# EAGLE schematic Atlas (EAGLE 9.2.2)
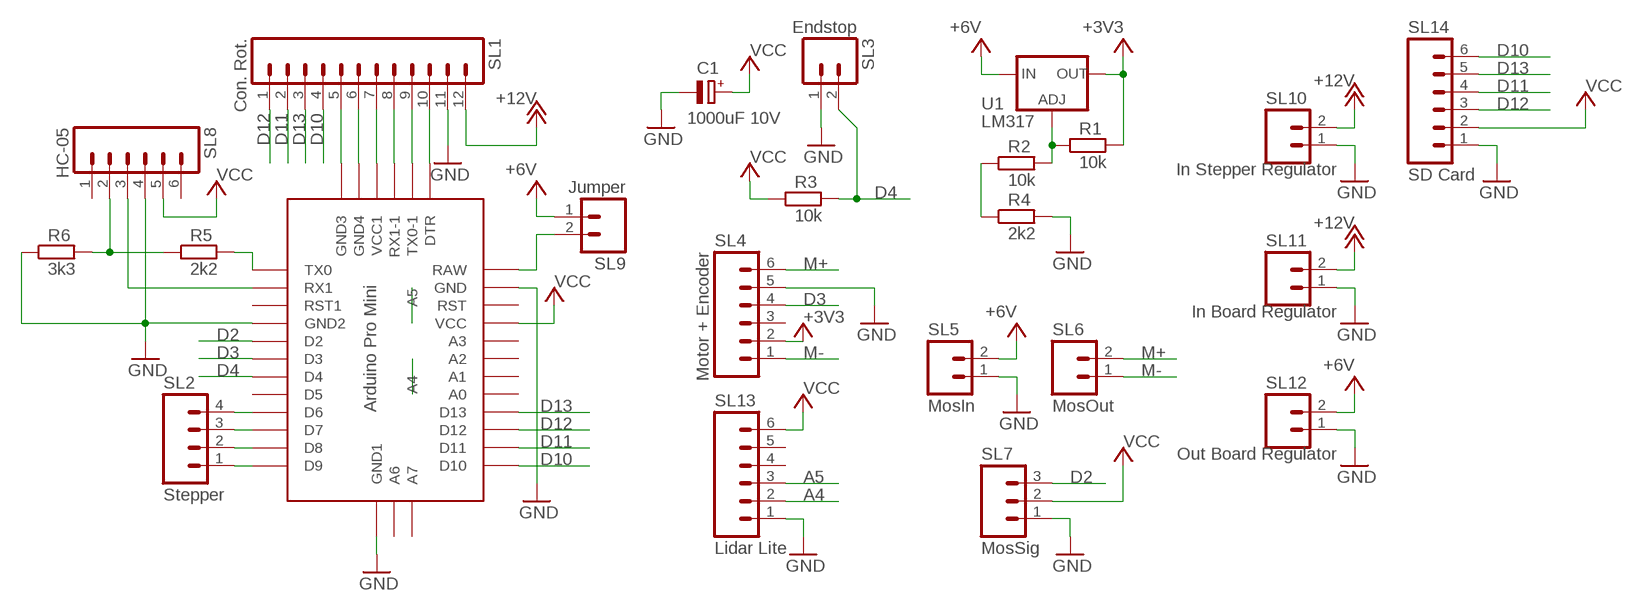
[diagram p0: schematic, sheet 1]

## Parts
C1  1000uF 10V  CPOL-EUE5-10.5  [E5-10,5]
R1  10k  R-EU_0207/10  [0207/10]
R2  10k  R-EU_0207/10  [0207/10]
R3  10k  R-EU_0207/10  [0207/10]
R4  2k2  R-EU_0207/10  [0207/10]
R5  2k2  R-EU_0207/10  [0207/10]
R6  3k3  R-EU_0207/10  [0207/10]
SL1  Con. Rot.  M12  [12P]
SL2  Stepper  M04  [04P]
SL3  Endstop  M02  [02P]
SL4  Motor + Encoder  M06  [06P]
SL5  MosIn  M02  [02P]
SL6  MosOut  M02  [02P]
SL7  MosSig  M03  [03P]
SL8  HC-05  M06  [06P]
SL9  Jumper  M02  [02P]
SL10  In Stepper Regulator  M02  [02P]
SL11  In Board Regulator  M02  [02P]
SL12  Out Board Regulator  M02  [02P]
SL13  Lidar Lite  M06  [06P]
SL14  SD Card  M06  [06P]
U1  LM317  V_REG_317SINK  [TO220-ADJ]
U$1  ABK-PRO-MINI  [ABK-PRO-MINI]

## Nets
+3V3: R1.2 SL4.2 U1.OUT
+6V: SL5.2 SL9.1 SL12.2 U1.IN
+12V: SL1.12 SL10.2 SL11.2
A4: SL13.2 U$1.A4
A5: SL13.3 U$1.A5
D2: SL7.3 U$1.D2
D3: SL4.4 U$1.D3
D4: R3.2 SL3.2 U$1.D4
D10: SL1.4 SL14.6 U$1.D10
D11: SL1.2 SL14.4 U$1.D11
D12: SL1.1 SL14.3 U$1.D12
D13: SL1.3 SL14.5 U$1.D13
GND: C1.- R4.2 R6.1 SL1.5 SL1.6 SL1.11 SL3.1 SL4.5 SL5.1 SL7.1 SL8.4 SL10.1 SL11.1 SL12.1 SL13.1 SL14.1 U$1.GND U$1.GND1(GND2) U$1.GND2(GND3) U$1.GND3(GND4) U$1.GND4(GND1)
M+: SL4.6 SL6.2
M-: SL4.1 SL6.1
N$1: R5.2 U$1.TX0
N$2: SL9.2 U$1.RAW
N$4: SL1.8 U$1.RX1-1
N$5: SL1.9 U$1.TX0-1
N$6: SL1.10 U$1.DTR
N$7: R2.1 R4.1
N$8: R5.1 R6.2 SL8.2
N$9: R1.1 R2.2 U1.ADJ
N$10: SL8.3 U$1.RX1
N$12: SL2.1 U$1.D9
N$13: SL2.2 U$1.D8
N$14: SL2.3 U$1.D7
N$15: SL2.4 U$1.D6
VCC: C1.+ R3.1 SL1.7 SL7.2 SL8.5 SL13.6 SL14.2 U$1.VCC U$1.VCC1
Unconnected: SL4.3 SL8.1 SL8.6 SL13.4 SL13.5 U$1.A0 U$1.A1 U$1.A2 U$1.A3 U$1.A6 U$1.A7 U$1.D5 U$1.RST U$1.RST1

## Library data of the parts
C1 = resistor:CPOL-EU: POLARIZED CAPACITOR, European symbol
R1-R6 = resistor:R-EU_: RESISTOR, European symbol
SL1 = con-amp-quick:M12: AMP QUICK CONNECTOR; OC_FARNELL: unknown; OC_NEWARK: unknown
SL2 = con-amp-quick:M04: AMP QUICK CONNECTOR; OC_FARNELL: unknown; OC_NEWARK: unknown
SL3 SL5 SL6 SL9-SL12 = con-amp-quick:M02: AMP QUICK CONNECTOR; OC_FARNELL: unknown; OC_NEWARK: unknown
SL4 SL8 SL13 SL14 = con-amp-quick:M06: AMP QUICK CONNECTOR; OC_FARNELL: unknown; OC_NEWARK: unknown
SL7 = con-amp-quick:M03: AMP QUICK CONNECTOR; OC_FARNELL: unknown; OC_NEWARK: unknown
U1 = SparkFun-IC-Power:V_REG_317: Voltage Regulator Standard LM317 adjustable voltage regulator. AOI (Adjust Output Input). Google 'LM317 Calculator' for easy to use app to get the two resistor values needed. 240/720 for 5V output. 240/390 for 3.3V output. Spark Fun Electronics SKU : COM-00527
U$1 = Arduino:ABK-PRO-MINI: ABK Pro-Mini Arduino Clone